# EAGLE design arduino ir receiver (EAGLE 9.0.1)
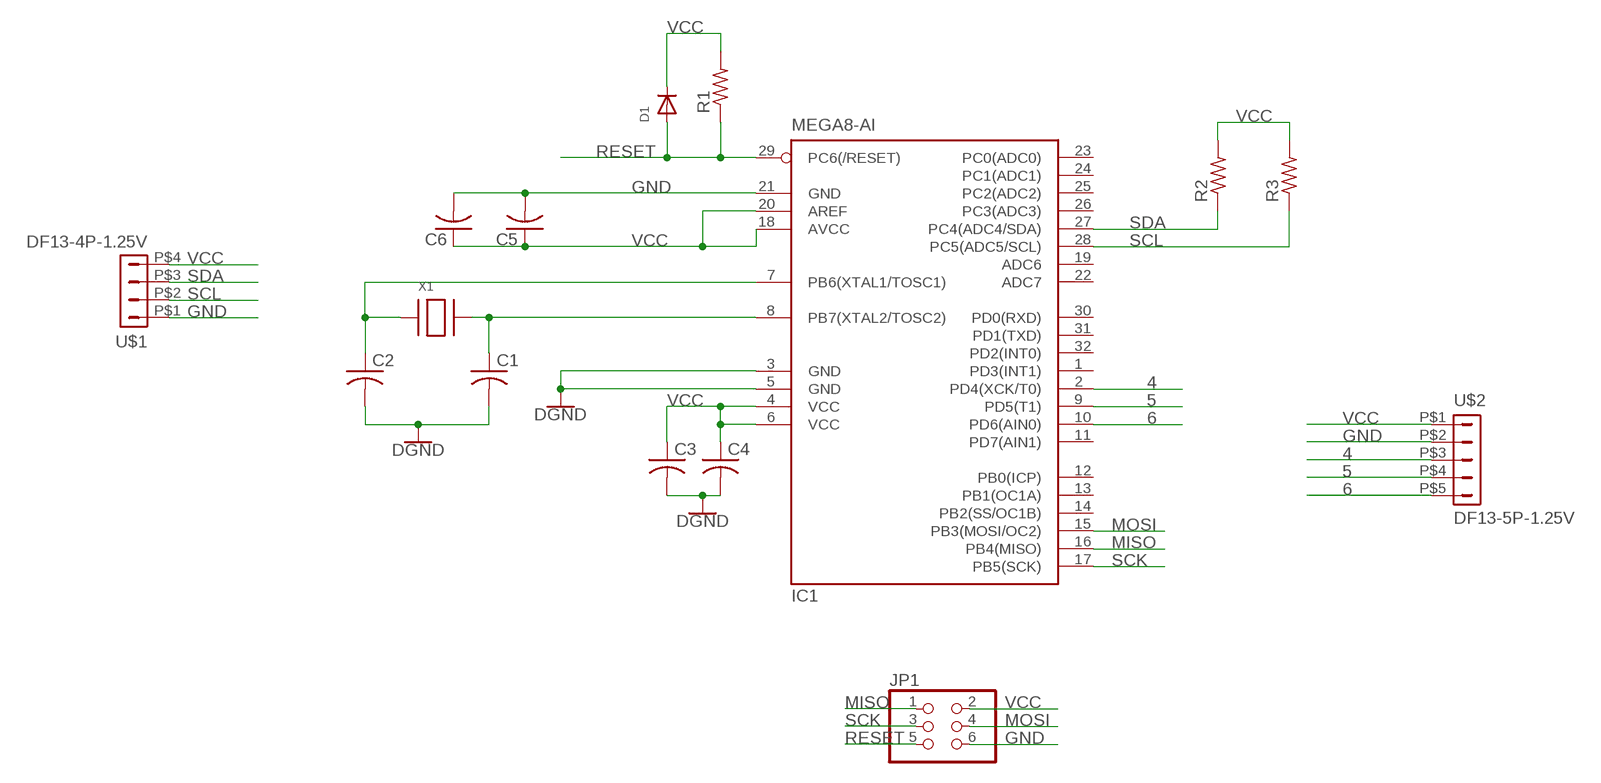
[diagram p0: schematic, sheet 1]

## Parts
C1  C-USC0805  [C0805]
C2  C-USC0805  [C0805]
C3  C-USC0805  [C0805]
C4  C-USC0805  [C0805]
C5  C-USC0805  [C0805]
C6  C-USC0805  [C0805]
D1  DIODESOD-123  [SOD-123]
IC1  MEGA8-AI  [TQFP32-08]
JP1  PINHD-2X3  [2X03]
R1  R-US_R0805  [R0805]
R2  R-US_R0805  [R0805]
R3  R-US_R0805  [R0805]
U$1  DF13-4P-1.25V  [DF13C-4P-1.25V]
U$2  DF13-5P-1.25V  [DF13C-5P-1.25V]
X1  XTALNX5032  [NX5032]

## Nets
4: IC1.2(PD4(XCK/T0)) U$2.P$3
5: IC1.9(PD5(T1)) U$2.P$4
6: IC1.10(PD6(AIN0)) U$2.P$5
GND: C1.2 C2.2 C3.2 C4.2 C5.2 C6.2 IC1.3(GND) IC1.5(GND) IC1.21(GND) JP1.6 U$1.P$1 U$2.P$2 ; supply symbol labelled DGND
MISO: IC1.16(PB4(MISO)) JP1.1
MOSI: IC1.15(PB3(MOSI/OC2)) JP1.4
N$1: C1.1 IC1.8(PB7(XTAL2/TOSC2)) X1.P$2
N$2: C2.1 IC1.7(PB6(XTAL1/TOSC1)) X1.P$1
RESET: D1.A IC1.29(PC6(/RESET)) JP1.5 R1.1
SCK: IC1.17(PB5(SCK)) JP1.3
SCL: IC1.28(PC5(ADC5/SCL)) R3.1 U$1.P$2
SDA: IC1.27(PC4(ADC4/SDA)) R2.1 U$1.P$3
VCC: C3.1 C4.1 C5.1 C6.1 D1.C IC1.4(VCC) IC1.6(VCC) IC1.18(AVCC) IC1.20(AREF) JP1.2 R1.2 R2.2 R3.2 U$1.P$4 U$2.P$1
Unconnected: IC1.1(PD3(INT1)) IC1.11(PD7(AIN1)) IC1.12(PB0(ICP)) IC1.13(PB1(OC1A)) IC1.14(PB2(SS/OC1B)) IC1.19(ADC6) IC1.22(ADC7) IC1.23(PC0(ADC0)) IC1.24(PC1(ADC1)) IC1.25(PC2(ADC2)) IC1.26(PC3(ADC3)) IC1.30(PD0(RXD)) IC1.31(PD1(TXD)) IC1.32(PD2(INT0))

## Library data of the parts
C1-C6 = rcl:C-US: CAPACITOR, American symbol; SPICEPREFIX: C
D1 = adafruit:DIODE: Diode SMADIODE - SMA Surface Mount Package 20V 1A Schottky Diode Digikey: 641-1014-6-ND DO-1N4148 - Through Hole Small Current Diode SOD-123 20V 1 A (.5mV Vf) Schottky Diode - Digikey: MBRX120TPMSCT-ND SOD-323 10V 570mA (.38mV Vf, 3ns) Schottky Diode - Digikey: ZLLS410CT-ND SOD-523 30V 30mA Schottky Diode (RB751S-40TE61) - Digikey: RB751S-40TE61CT-ND SOT23-R/W - SOT23 Package (R = Solder Paste/Reflow Ovens, W = Hand-Soldering) BAT54Film 40V 300mA - Digikey: 497-7162-1-ND
IC1 = atmel:MEGA8: MICROCONTROLLER 8 Kbytes FLASH, 1 kbytes SRAM, 512 bytes EEPROM, USART, 6-channel 10 bit ADC, 2-channel 8 bit ADC Pin compatible with Atmega48, ATMega88, ATMega168 Source: avr.lbr; MPN: ATMEGA8-16AU; OC_FARNELL: 9171371; OC_NEWARK: 73M8863
JP1 = pinhead:PINHD-2X3: PIN HEADER
R1-R3 = rcl:R-US_: RESISTOR, American symbol; SPICEPREFIX: R
U$1 = con-hirose-df13:DF13-4P-1.25: DF13-4P 1.25mm Pitch Miniature Crimping Connector.
U$2 = con-hirose-df13:DF13-5P-1.25: DF13-5P 1.25mm Pitch Miniature Crimping Connector.
X1 = adafruit:XTAL: Low cost SMT crystals, no capacitors included http://www.ladyada.net/library/eagle

## Board
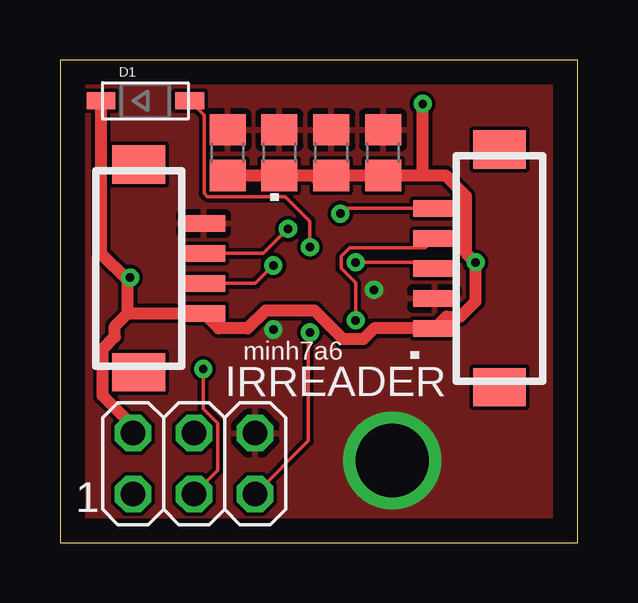
[diagram p1: board, top side]
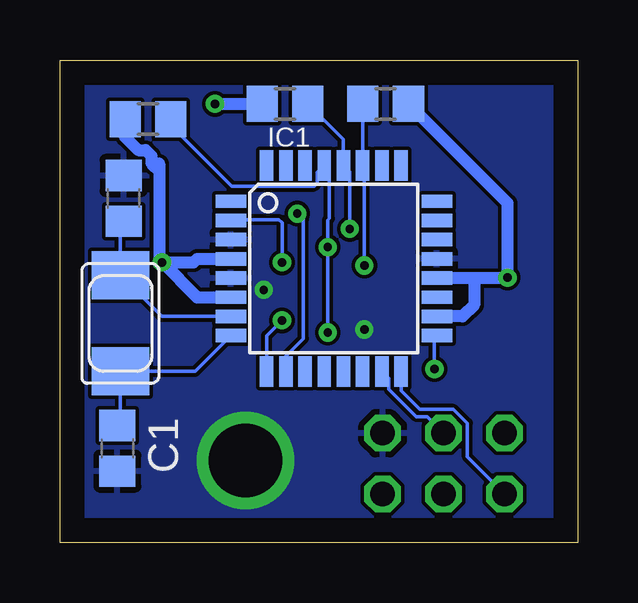
[diagram p2: board, bottom side, seen from below]

Size 21.57 x 20.12 mm. Coordinates in mm from the lower left corner, seen from the top.
Outline: 0,0 21.57,0 21.57,20.12 0,20.12 0,0
Copper layers (1*16): Top 0.035mm / dielectric 1.5mm / Bottom 0.035mm
Design rules "default": minimum track width 6mil, minimum drill 0.35mm, track to track 6mil, track to pad 6mil, pad to pad 6mil, via to via 6mil, smd to smd 6mil, copper to edge 40mil, drill to drill 6mil, minimum pad ring 10mil, minimum via ring 8mil, stop-mask expansion 4mil, vias tented up to drill 0mil, thermal gap 10mil

### Footprints (pad centres in the part's own frame; a part is rotated, then mirrored left to right if it is on the bottom)
C0805 = smd 1.3 x 1.5: 1 -0.95,0; 2 0.95,0
SOD-123 = smd 1.2 x 0.7: A 1.85,0; C -1.85,0
TQFP32-08 = smd 1.27 x 0.559: 1 -4.293,2.8; 2 -4.293,2; 3 -4.293,1.2; 4 -4.293,0.4; 5 -4.293,-0.4; 6 -4.293,-1.2; 7 -4.293,-2; 8 -4.293,-2.8; 17 4.293,-2.8; 18 4.293,-2; 19 4.293,-1.2; 20 4.293,-0.4; 21 4.293,0.4; 22 4.293,1.2; 23 4.293,2; 24 4.293,2.8 | smd 0.559 x 1.27: 9 -2.8,-4.293; 10 -2,-4.293; 11 -1.2,-4.293; 12 -0.4,-4.293; 13 0.4,-4.293; 14 1.2,-4.293; 15 2,-4.293; 16 2.8,-4.293; 25 2.8,4.293; 26 2,4.293; 27 1.2,4.293; 28 0.4,4.293; 29 -0.4,4.293; 30 -1.2,4.293; 31 -2,4.293; 32 -2.8,4.293
2X03 = drill 1.016 octagon: 1 -2.54,-1.27; 2 -2.54,1.27; 3 0,-1.27; 4 0,1.27; 5 2.54,-1.27; 6 2.54,1.27
R0805 = smd 1.3 x 1.5: 1 -0.95,0; 2 0.95,0
DF13C-4P-1.25V = smd 1.6 x 2.2: M$0 4.325,-1.8; M$1 -4.325,-1.8 | smd 0.7 x 1.8: P$1 -1.875,0.9; P$2 -0.625,0.9; P$3 0.625,0.9; P$4 1.875,0.9
DF13C-5P-1.25V = smd 1.6 x 2.2: M$0 4.95,-1.8; M$1 -4.95,-1.8 | smd 0.7 x 1.8: P$1 -2.5,0.9; P$2 -1.25,0.9; P$3 0,0.9; P$4 1.25,0.9; P$5 2.5,0.9
NX5032 = smd 2 x 2.4: P$1 2,0; P$2 -2,0

### Placement (x,y rotation side)
C1  19.18,3.94 270 bottom
C2  18.92,14.35 90 bottom
C3  11.3,16.26 90 top
C4  9.14,16.26 90 top
C5  13.46,16.26 90 top
C6  6.99,16.26 90 top
D1  3.56,18.41 0 top
IC1  10.16,11.43 0 bottom
JP1  5.59,3.3 0 top
R1  17.91,17.65 180 bottom
R2  8,18.29 0 bottom
R3  12.19,18.29 180 bottom
U$1  5.08,11.43 270 top
U$2  16.51,11.43 90 top
X1  19.05,9.14 90 bottom

### Tracks (layer width: path | path; a pad name or v marks a point on that pad's centre or on a via)
4  (via drill 0.35)
  Top 0.152: U$2.P$3 15.36,11.68 v12.32,11.68
  Bottom 0.152: v12.32,11.68 12.32,13.34 12.45,13.46 14.42,13.46 IC1.2
5  (via drill 0.35)
  Top 0.152: U$2.P$4 15.22,12.29 12.07,12.29 11.71,11.93 11.71,11.43 12.32,10.83 v12.32,9.27
  Bottom 0.152: IC1.9 12.96,8.63 v12.32,9.27
6  (via drill 0.35)
  Top 0.152: v11.68,13.72 11.9,13.93 U$2.P$5
  Bottom 0.152: IC1.10 12.16,7.78 11.43,8.51 11.43,13.46 v11.68,13.72
GND  (via drill 0.35, 3.05)
  other vias: 8.89,8.89 13.84,3.43 13.08,10.54
  pour Bottom: -2.54,22.86 -2.54,-2.54 24.13,-2.54 24.13,22.86
  pour Top: -1.27,0 -1.27,21.59 22.86,21.59 22.86,0 22.86,-1.27 -1.27,-1.27
MISO
  Bottom 0.152: IC1.16 7.36,6.34 6.58,5.56 5.18,5.56 4.6,4.98 4.6,3.58 JP1.1
MOSI
  Bottom 0.152: IC1.15 7.87,6.85 7.87,6.41 6.72,5.26 6.27,5.26 JP1.4
N$1
  Bottom 0.152: C1.1 19.05,5.01 X1.P$2 15.94,7.14 IC1.8
N$2
  Bottom 0.152: C2.1 19.05,13.27 X1.P$1 17.34,9.43 IC1.7
RESET  (via drill 0.35)
  Top 0.152: JP1.5 10.34,4.25 10.34,8.69 v10.41,8.76 | D1.A 6.01,17.82 6.01,14.56 6.14,14.43 9.39,14.43 10.41,13.41 v10.41,12.32
  Bottom 0.152: 10.6,15.68 10.85,15.43 10.85,14.99 10.99,14.86 14.42,14.86 16.96,17.4 R1.1 | 10.6,15.68 IC1.29 | 10.6,15.68 10.34,15.42 10.34,13.52 10.41,13.45 v10.41,12.32 v10.41,8.76
SCK  (via drill 0.35)
  Top 0.152: v5.97,7.24 5.97,5.59 6.58,4.98 6.58,3.02 JP1.3
  Bottom 0.152: v5.97,7.24 5.97,8.53 IC1.17
SCL  (via drill 0.35)
  Top 0.152: U$1.P$2 8.47,12.05 v9.5,13.08
  Bottom 0.152: R3.1 9.76,16.81 IC1.28 9.5,15.46 v9.5,13.08
SDA  (via drill 0.35)
  Top 0.152: U$1.P$3 8.14,10.8 v8.89,11.56
  Bottom 0.152: IC1.27 8.96,15.75 | 8.96,15.75 R2.1 | v8.89,11.56 8.89,15.68 8.96,15.75
VCC  (via drill 0.35)
  Top 0.508: JP1.2 3.05,4.86 1.77,6.14 1.77,8.07 2.29,8.59 2.29,9.02 2.82,9.55 | 2.82,9.55 U$1.P$4 6.6,8.93 7.82,8.93 8.57,9.68 10.61,9.68 11.8,8.49 12.64,8.49 13.09,8.93 U$2.P$1 | 15.51,8.83 U$2.P$1 | 2.82,9.55 2.82,10.95 | 2.82,10.95 v2.92,11.05 | C3.1 C4.1 C6.1 | C3.1 10.67,15.18 | 15.11,15.31 C5.1 C3.1 | 15.11,15.31 16.06,15.31 16.92,14.45 16.92,12.09 v17.32,11.68 17.32,10.07 16.68,9.42 16.1,9.42 U$2.P$1 | 15.11,15.31 v15.11,18.29 | D1.C 1.71,12.07 2.82,10.95
  Bottom 0.508: 4.32,11.03 2.94,11.03 v2.92,11.05 2.92,14.16 R2.2 | 4.32,11.03 IC1.20 | v17.32,11.68 15.87,10.23 IC1.6 | v17.32,11.68 16,11.68 15.86,11.83 IC1.4 | v15.11,18.29 R3.2 | v17.32,11.68 17.44,11.81 17.44,15.49 | 17.44,15.8 17.44,15.49 | 4.32,11.03 4.32,9.91 4.79,9.43 IC1.18 | R1.2 18.86,16.91 18.31,16.36 18.01,16.36 17.77,16.12 17.77,15.82 17.44,15.49

### Text on the board
tPlace: minh7a6 | IRREADER | 1